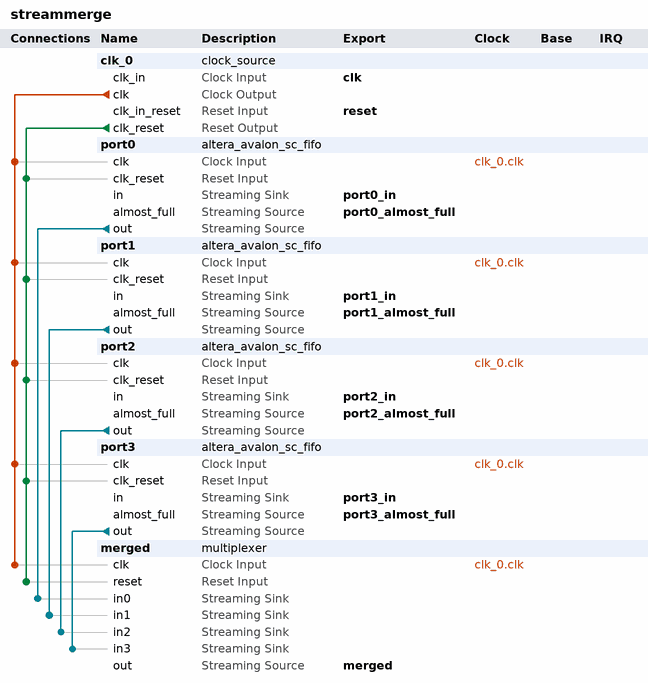
[diagram p0: system contents]
# Platform Designer (Qsys) system streammerge, Stratix V 5SGXEA7N2F45C2
# Parameters at their usual value, and those the tool derives, are not listed.
package require -exact qsys 16.1
create_system streammerge
set_project_property DEVICE_FAMILY {Stratix V}
set_project_property DEVICE 5SGXEA7N2F45C2

add_instance clk_0 clock_source 16.1
set_instance_parameter_value clk_0 clockFrequency 50000000

add_instance port0 altera_avalon_sc_fifo 16.1
set_instance_parameter_value port0 BITS_PER_SYMBOL 8
set_instance_parameter_value port0 CHANNEL_WIDTH 0
set_instance_parameter_value port0 ERROR_WIDTH 0
set_instance_parameter_value port0 FIFO_DEPTH 4
set_instance_parameter_value port0 SYMBOLS_PER_BEAT 8
set_instance_parameter_value port0 USE_ALMOST_FULL_IF 1
set_instance_parameter_value port0 USE_FILL_LEVEL 1
set_instance_parameter_value port0 USE_MEMORY_BLOCKS 1
set_instance_parameter_value port0 USE_PACKETS 1
set_instance_parameter_value port0 USE_STORE_FORWARD 0

add_instance port1 altera_avalon_sc_fifo 16.1
set_instance_parameter_value port1 BITS_PER_SYMBOL 8
set_instance_parameter_value port1 CHANNEL_WIDTH 0
set_instance_parameter_value port1 ERROR_WIDTH 0
set_instance_parameter_value port1 FIFO_DEPTH 4
set_instance_parameter_value port1 SYMBOLS_PER_BEAT 8
set_instance_parameter_value port1 USE_ALMOST_FULL_IF 1
set_instance_parameter_value port1 USE_FILL_LEVEL 1
set_instance_parameter_value port1 USE_MEMORY_BLOCKS 1
set_instance_parameter_value port1 USE_PACKETS 1
set_instance_parameter_value port1 USE_STORE_FORWARD 0

add_instance port2 altera_avalon_sc_fifo 16.1
set_instance_parameter_value port2 BITS_PER_SYMBOL 8
set_instance_parameter_value port2 CHANNEL_WIDTH 0
set_instance_parameter_value port2 ERROR_WIDTH 0
set_instance_parameter_value port2 FIFO_DEPTH 4
set_instance_parameter_value port2 SYMBOLS_PER_BEAT 8
set_instance_parameter_value port2 USE_ALMOST_FULL_IF 1
set_instance_parameter_value port2 USE_FILL_LEVEL 1
set_instance_parameter_value port2 USE_MEMORY_BLOCKS 1
set_instance_parameter_value port2 USE_PACKETS 1
set_instance_parameter_value port2 USE_STORE_FORWARD 0

add_instance port3 altera_avalon_sc_fifo 16.1
set_instance_parameter_value port3 BITS_PER_SYMBOL 8
set_instance_parameter_value port3 CHANNEL_WIDTH 0
set_instance_parameter_value port3 ERROR_WIDTH 0
set_instance_parameter_value port3 FIFO_DEPTH 4
set_instance_parameter_value port3 SYMBOLS_PER_BEAT 8
set_instance_parameter_value port3 USE_ALMOST_FULL_IF 1
set_instance_parameter_value port3 USE_FILL_LEVEL 1
set_instance_parameter_value port3 USE_MEMORY_BLOCKS 1
set_instance_parameter_value port3 USE_PACKETS 1
set_instance_parameter_value port3 USE_STORE_FORWARD 0

add_instance merged multiplexer 16.1
set_instance_parameter_value merged bitsPerSymbol 8
set_instance_parameter_value merged errorWidth 0
set_instance_parameter_value merged numInputInterfaces 4
set_instance_parameter_value merged outChannelWidth 2
set_instance_parameter_value merged packetScheduling true
set_instance_parameter_value merged schedulingSize 2
set_instance_parameter_value merged symbolsPerBeat 8
set_instance_parameter_value merged useHighBitsOfChannel true
set_instance_parameter_value merged usePackets true

# connections
add_connection clk_0.clk merged.clk clock
add_connection clk_0.clk port0.clk clock
add_connection clk_0.clk port1.clk clock
add_connection clk_0.clk port2.clk clock
add_connection clk_0.clk port3.clk clock
add_connection clk_0.clk_reset merged.reset reset
add_connection clk_0.clk_reset port0.clk_reset reset
add_connection clk_0.clk_reset port1.clk_reset reset
add_connection clk_0.clk_reset port2.clk_reset reset
add_connection clk_0.clk_reset port3.clk_reset reset
add_connection port0.out merged.in0 avalon_streaming
add_connection port1.out merged.in1 avalon_streaming
add_connection port2.out merged.in2 avalon_streaming
add_connection port3.out merged.in3 avalon_streaming

# exported interfaces
add_interface clk clock sink
set_interface_property clk EXPORT_OF clk_0.clk_in
add_interface merged avalon_streaming source
set_interface_property merged EXPORT_OF merged.out
add_interface port0_almost_full avalon_streaming source
set_interface_property port0_almost_full EXPORT_OF port0.almost_full
add_interface port0_in avalon_streaming sink
set_interface_property port0_in EXPORT_OF port0.in
add_interface port1_almost_full avalon_streaming source
set_interface_property port1_almost_full EXPORT_OF port1.almost_full
add_interface port1_in avalon_streaming sink
set_interface_property port1_in EXPORT_OF port1.in
add_interface port2_almost_full avalon_streaming source
set_interface_property port2_almost_full EXPORT_OF port2.almost_full
add_interface port2_in avalon_streaming sink
set_interface_property port2_in EXPORT_OF port2.in
add_interface port3_almost_full avalon_streaming source
set_interface_property port3_almost_full EXPORT_OF port3.almost_full
add_interface port3_in avalon_streaming sink
set_interface_property port3_in EXPORT_OF port3.in
add_interface reset reset sink
set_interface_property reset EXPORT_OF clk_0.clk_in_reset

set_interconnect_requirement {$system} qsys_mm.clockCrossingAdapter HANDSHAKE
set_interconnect_requirement {$system} qsys_mm.enableEccProtection FALSE
set_interconnect_requirement {$system} qsys_mm.insertDefaultSlave FALSE
set_interconnect_requirement {$system} qsys_mm.maxAdditionalLatency 1

save_system streammerge.qsys
